# Altium project EN1093.PrjPcb
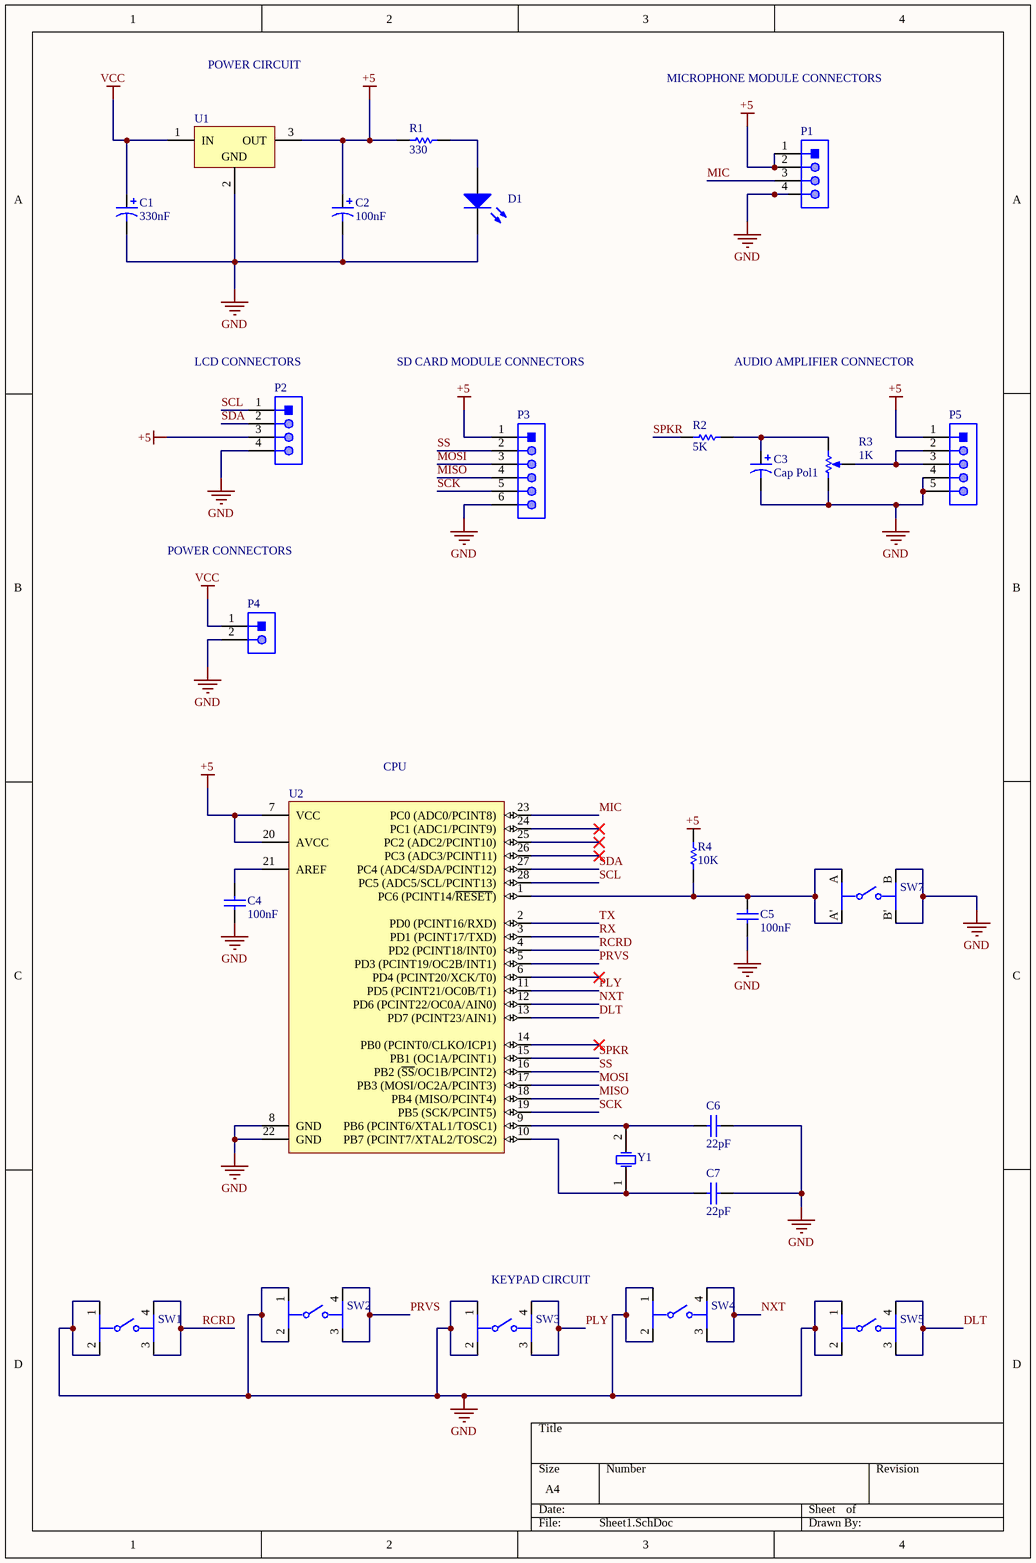
[diagram p0: Sheet1.SchDoc]
1 sheet, 26 parts. Net scope: global (net labels, ports and power ports of the same name join across sheets).
Board file: PCB_EN1093.PcbDoc

## Sheet Sheet1.SchDoc
size A4 portrait; SheetNumber: 1; SheetTotal: 1

### Parts
C1  330nF  [RB7.6-15]
C2  100nF  [RB7.6-15]
C3  Cap Pol1  [RB7.6-15]
C4  100nF  [RAD-0.3]
C5  100nF  [RAD-0.3]
C6  22pF  [RAD-0.3]
C7  22pF  [RAD-0.3]
D1  LED1  [LED-1]  (value not drawn)
P1  620104131822  [620104131822]  (value not drawn)
P2  620104131822  [620104131822]  (value not drawn)
P3  66200611122  [66200611122]  (value not drawn)
P4  620302124022  [620302124022]  (value not drawn)
P5  620305124022  [620305124022]  (value not drawn)
R1  330  [AXIAL-0.3]
R2  5K  [AXIAL-0.3]
R3  1K  [VR5]
R4  10K  [AXIAL-0.3]
SW1  B3FS-4052P  [FP-B3FS-4052P-MFG]  (value not drawn)
SW2  B3FS-4052P  [FP-B3FS-4052P-MFG]  (value not drawn)
SW3  B3FS-4052P  [FP-B3FS-4052P-MFG]  (value not drawn)
SW4  B3FS-4052P  [FP-B3FS-4052P-MFG]  (value not drawn)
SW5  B3FS-4052P  [FP-B3FS-4052P-MFG]  (value not drawn)
SW7  EVQ-PAG07K  [FP-EVQ-PAG07K-MFG]  (value not drawn)
U1  L7805CV  [TO220]  (value not drawn)
U2  ATmega328P-PU  [28P3]  (value not drawn)
Y1  XTAL  [R38]  (value not drawn)

### Nets
+5: C2.1 P1.1 P1.2 P2.3 P3.1 P5.1 R1.1 U1.3(OUT) U2.7(VCC) U2.20(AVCC)
GND: C1.2 C2.2 C3.2 C4.1 C5.1 C6.1 C7.1 D1.2(K) P1.4 P2.4 P3.6 P4.2 P5.4 P5.5 R3.1(TOP) SW1.1 SW1.2 SW2.1 SW2.2 SW3.1 SW3.2 SW4.1 SW4.2 SW5.1 SW5.2 SW7.B SW7.B' U1.2(GND) U2.8(GND) U2.22(GND)
VCC: C1.1 P4.1 U1.1(IN)
DLT: SW5.3 SW5.4 U2.13(PD7_(PCINT23/AIN1))
MIC: P1.3 U2.23(PC0_(ADC0/PCINT8))
MISO: P3.4 U2.18(PB4_(MISO/PCINT4))
MOSI: P3.3 U2.17(PB3_(MOSI/OC2A/PCINT3))
NXT: SW4.3 SW4.4 U2.12(PD6_(PCINT22/OC0A/AIN0))
PLY: SW3.3 SW3.4 U2.11(PD5_(PCINT21/OC0B/T1))
PRVS: SW2.3 SW2.4 U2.5(PD3_(PCINT19/OC2B/INT1))
RCRD: SW1.3 SW1.4 U2.4(PD2_(PCINT18/INT0))
RX: U2.3(PD1_(PCINT17/TXD))
SCK: P3.5 U2.19(PB5_(SCK/PCINT5))
SCL: P2.1 U2.28(PC5_(ADC5/SCL/PCINT13))
SDA: P2.2 U2.27(PC4_(ADC4/SDA/PCINT12))
SPKR: R2.2 U2.15(PB1_(OC1A/PCINT1))
SS: P3.2 U2.16(PB2_(~{SS}/OC1B/PCINT2))
TX: U2.2(PD0_(PCINT16/RXD))
NetC3_1: C3.1 R2.1 R3.2(BOT)
NetC4_2: C4.2 U2.21(AREF)
NetC5_2: C5.2 R4.2 SW7.A SW7.A' U2.1(PC6_(PCINT14/~{RESET}))
NetC6_2: C6.2 U2.9(PB6_(PCINT6/XTAL1/TOSC1)) Y1.2(OSC2)
NetC7_2: C7.2 U2.10(PB7_(PCINT7/XTAL2/TOSC2)) Y1.1(OSC1)
NetD1_1: D1.1(A) R1.2
NetP5_2: P5.2 P5.3 R3.3(TAP)

Not connected (* = marked no-connect by the designer): R4 1; U2 6(PD4_(PCINT20/XCK/T0))* 14(PB0_(PCINT0/CLKO/ICP1))* 24(PC1_(ADC1/PCINT9))* 25(PC2_(ADC2/PCINT10))* 26(PC3_(ADC3/PCINT11))*

### Notes on the sheet
- POWER CIRCUIT
- MICROPHONE MODULE CONNECTORS
- (near P2) LCD CONNECTORS
- SD CARD MODULE CONNECTORS
- AUDIO AMPLIFIER CONNECTOR
- POWER CONNECTORS
- (near U2) CPU
- (near SW3) KEYPAD CIRCUIT
- Labels drawn without touching a wire or pin: +5

### Library data of the parts
C1 C2 = Cap Pol1: Polarized Capacitor (Radial); Published: 8-Jun-2000; LatestRevisionDate: 17-Jul-2002; LatestRevisionNote: Re-released for DXP Platform.; PackageReference: RB7.6-15; Publisher: Altium Limited; PackageDescription: Polarized Capacitor (Radial); 2 Leads
  C1: Value: 330nF
  C2: Value: 100nF
C3 = Cap Pol1: Polarized Capacitor (Radial); Value: 10pF; Published: 8-Jun-2000; LatestRevisionDate: 17-Jul-2002; LatestRevisionNote: Re-released for DXP Platform.; PackageReference: RB7.6-15; Publisher: Altium Limited; PackageDescription: Polarized Capacitor (Radial); 2 Leads
C4-C7 = Cap: Capacitor; Published: 8-Jun-2000; LatestRevisionDate: 17-Jul-2002; LatestRevisionNote: Re-released for DXP Platform.; PackageReference: RAD-0.3; Publisher: Altium Limited; PackageDescription: Radial Cap, Thru-Hole; 2 Leads; 0.3 in Pin Spacing
  C4 C5: Value: 100nF
  C6 C7: Value: 22pF
D1 = LED1: Typical RED GaAs LED; Published: 8-Jun-2000; LatestRevisionDate: 08-Jul-2005; LatestRevisionNote: Mech Layer 1 removed.; PackageReference: LED-1; Publisher: Altium Limited; PackageDescription: LED; 2 Leads
P1 P2 = CMP-1502-00671-1: Male Shrouded Header WR-WTB, SMT, Right Angled, pitch 2 mm, 1 x 4 position; Manufacturer: Wurth Elektronik; Contact Resistance: 20mOhm; Position: 1x4; Pitch: 2mm; Working Voltage: 100VAC; Orientation: RightAngled; Publisher: WurthElektronik; Mounting Technology: SMT; Datasheet URL: https://katalog.we-online.de/em/datasheet/6201xx131822.pdf; Gender: Male; Part Number: 620104131822; Packaging: TapeandReel; Operating Temperature: -25to85degC; Manufacturer URL: http://www.we-online.de; Package Reference: 620104131822
P3 = CMP-1502-00444-1: THT Male Header WR-MPC3, Vertical, Single Row, pitch 3 mm, 6 pins; Manufacturer: Wurth Elektronik; Working Voltage: 250VAC; Contact Resistance: 10mOhm; Pin Number: 6; Pitch: 3mm; Package Reference: 66200611122; Manufacturer URL: http://www.we-online.de; Packaging: Tube; Operating Temperature: -40to105degC; Publisher: WurthElektronik; Datasheet URL: https://katalog.we-online.de/em/datasheet/6620xx11122.pdf; Mounting Technology: THT; Gender: Male; Part Number: 66200611122; Orientation: Vertical
P4 = CMP-1502-00660-1: Male Shrouded Header WR-WTB, SMT, Vertical, pitch 2 mm, 1 x 2 position; Manufacturer: Wurth Elektronik; Pitch: 2mm; Position: 1x2; Working Voltage: 100VAC; Contact Resistance: 20mOhm; Package Reference: 620302124022; Manufacturer URL: http://www.we-online.de; Gender: Male; Orientation: Vertical; Publisher: WurthElektronik; Mounting Technology: SMT; Operating Temperature: -25to85degC; Datasheet URL: https://katalog.we-online.de/em/datasheet/6203xx124022.pdf; Packaging: TapeandReel; Part Number: 620302124022
P5 = CMP-1502-00663-1: Male Shrouded Header WR-WTB, SMT, Vertical, pitch 2 mm, 1 x 5 position; Manufacturer: Wurth Elektronik; Contact Resistance: 20mOhm; Working Voltage: 100VAC; Position: 1x5; Pitch: 2mm; Packaging: TapeandReel; Operating Temperature: -25to85degC; Part Number: 620305124022; Manufacturer URL: http://www.we-online.de; Mounting Technology: SMT; Publisher: WurthElektronik; Datasheet URL: https://katalog.we-online.de/em/datasheet/6203xx124022.pdf; Package Reference: 620305124022; Gender: Male; Orientation: Vertical
R1 R2 R4 = Res1: Resistor; Published: 8-Jun-2000; LatestRevisionDate: 17-Jul-2002; LatestRevisionNote: Re-released for DXP Platform.; PackageReference: AXIAL-0.3; Publisher: Altium Limited; PackageDescription: Axial Device, Thru-Hole; 2 Leads; 0.3 in Pin Spacing
  R1: Value: 330
  R2: Value: 5K
  R4: Value: 10K
R3 = RPot: Potentiometer; Sim Note: Enter the Resistance value and the set point into parameter fields.; Set Position: 0.5; Published: 8-Jun-2000; LatestRevisionDate: 17-Jul-2002; LatestRevisionNote: Re-released for DXP Platform.; PackageReference: VR5; Publisher: Altium Limited; PackageDescription: Variable Resistor, Thru-Hole; 3 Leads; Value: 1K
SW1-SW5 = CMP-08834-000051-1: SWITCH TACT SPST-NO 0.05A 24V; Mechanical Life: 3000000Cycles; Illumination Type: Non-Illuminated; Switch Travel: 0.25mm; Operating Force: 150gf; Switch Function: Off-Mom; Throw Configuration: SPST; Termination: Gull Wing; RoHS Compliant: Yes; Packaging: Tape and Reel; Max Operating Temperature: 70°C; Min Operating Temperature: -25°C; Mount: Surface Mount; Radiation Hardening: No; Max Voltage Rating (DC): 24V
SW7 = CMP-05618-000034-1: SWITCH TACTILE SPST-NO 0.02A 15V; Contact Current Rating: 20mA; Switch Function: Off-Mom; Illumination Type: Non-Illuminated; Switch Travel: 0.25mm; Operating Force: 2.6N; Actuator Color: Black; Actuator Length: 3.1mm; Contact Resistance: 50mR; Throw Configuration: SPST; Electrical Life: 50000Cycles; Actuator Type: Standard; Mount: Through Hole; Package Quantity: 500; RoHS Compliant: Yes; Packaging: Bulk; Orientation: Straight; Current Rating: 20mA; Voltage Rating (DC): 15V; Series: EVQPA; Length: 6mm; Termination: PC Pin; Max Current Rating: 20mA; Min Operating Temperature: -20°C; Size: 6mm; Depth: 7.8mm; Max Operating Temperature: 70°C; Mechanical Life: 50000Cycles; Lead Free: Lead Free; Max Voltage Rating (DC): 15V; Radiation Hardening: No
U1 = CMP-0244-00483-1: Positive Voltage Regulator, 5V, 3-Pin TO-220; PackageDescription: TO, Thru-Hole, Vertical, Heatsink Mounted; 3 In-Line Leads; Pitch 2.54 mm; ComponentLink2Description: Datasheet; PackageReference: TO220; ComponentLink3URL: http://www.st.com/internet/com/TECHNICAL_RESOURCES/TECHNICAL_LITERATURE/PACKAGE_INFORMATION/CD00004649.pdf; DatasheetVersion: 16/11/2011; ComponentLink1Description: Manufacturer URL; ComponentLink1URL: http://www.st.com; PackageVersion: ver3.0; ComponentLink3Description: Package Specification; ComponentLink2URL: http://www.st.com/internet/com/TECHNICAL_RESOURCES/TECHNICAL_LITERATURE/DATASHEET/CD00000444.pdf
U2 = CMP-0095-00013-2: 8-bit AVR Microcontroller, 32KB Flash, 1KB EEPROM, 2KB SRAM, 28-pin PDIP, Industrial Grade (-40°C to 85°C); RevisionNote: DatasheetVersion updated. URLs added.; PackageVersion: revB, Sep-2001; PackageDescription: 28-lead (0.300"/7.62mm Wide) Plastic Dual Inline Package (PDIP); DatasheetVersion: revD, May-2011; ComponentLink1Description: Manufacturer URL; ComponentLink1URL: http://www.atmel.com/; PackageReference: 28P3; ComponentLink2Description: ATmega48A/48PA/88A/88PA/168A/168PA/328/328P Datasheet; ComponentLink3URL: http://www.atmel.com/dyn/resources/prod_documents/8271S.pdf; ComponentLink2URL: http://www.atmel.com/dyn/resources/prod_documents/8271.pdf; ComponentLink3Description: ATmega48A/48PA/88A/88PA/168A/168PA/328/328P Summary
Y1 = XTAL: Crystal Oscillator; Published: 8-Jun-2000; LatestRevisionDate: 17-Jul-2002; LatestRevisionNote: Re-released for DXP Platform.; PackageReference: R38; Publisher: Altium Limited; PackageDescription: Crystal, Thru-Hole; 2 Leads; Body 3.1 x 8.2 mm (Dia.xH)